# EAGLE schematic bitslice (EAGLE 6.3)
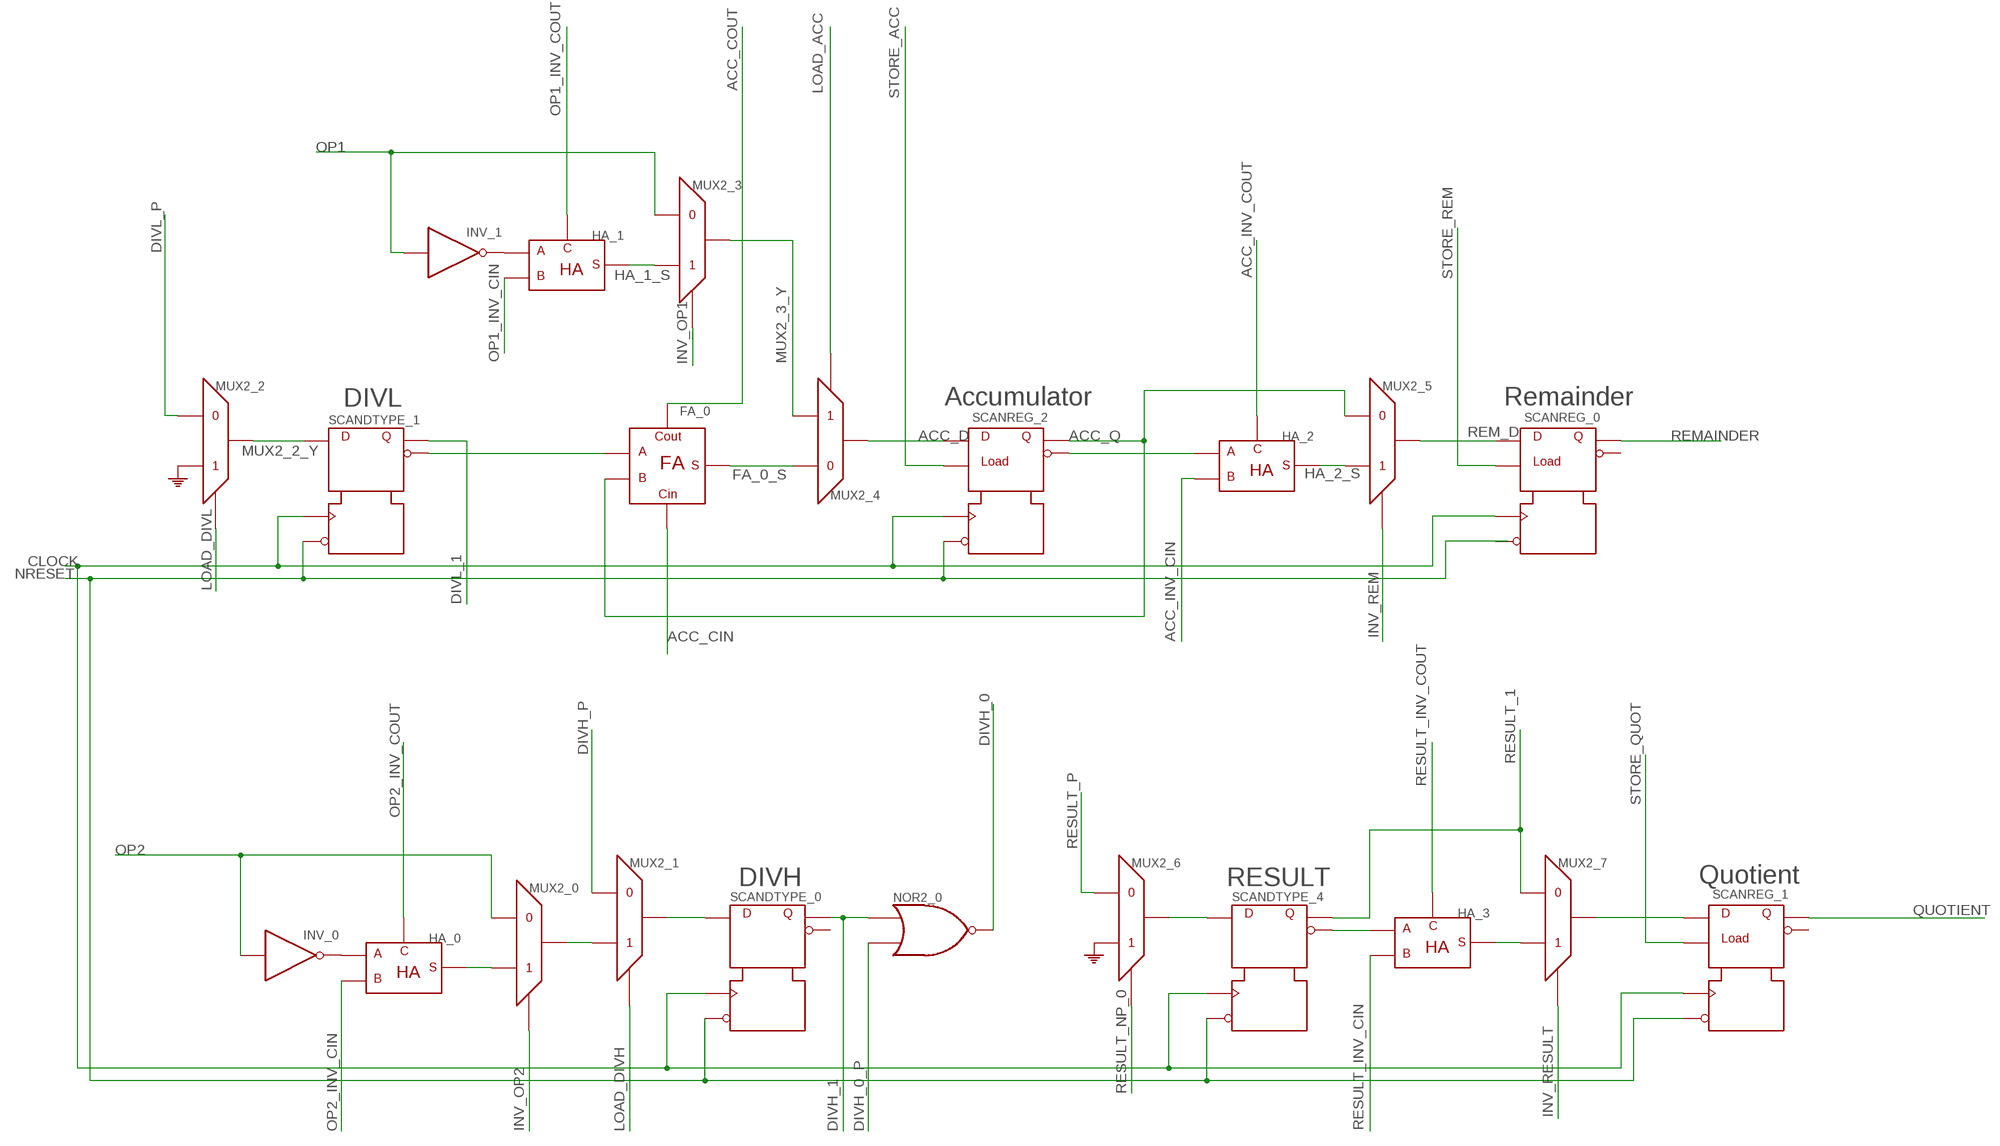
[diagram p0: schematic, sheet 1]

## Parts
FA_0  FULLADDER  [5PIN]
HA_0  HALFADDER  [5PIN]
HA_1  HALFADDER  [5PIN]
HA_2  HALFADDER  [5PIN]
HA_3  HALFADDER  [5PIN]
INV_0  INV  [3PIN]
INV_1  INV  [3PIN]
MUX2_0  MUX2  [5PIN]
MUX2_1  MUX2  [5PIN]
MUX2_2  MUX2  [5PIN]
MUX2_3  MUX2  [5PIN]
MUX2_4  MUX2  [5PIN]
MUX2_5  MUX2  [5PIN]
MUX2_6  MUX2  [5PIN]
MUX2_7  MUX2  [5PIN]
NOR2_0  NOR2  [3PIN]
SCANDTYPE_0  SCANDTYPE  [5PIN]
SCANDTYPE_1  SCANDTYPE  [5PIN]
SCANDTYPE_4  SCANDTYPE  [5PIN]
SCANREG_0  SCANREG  [6PIN]
SCANREG_1  SCANREG  [6PIN]
SCANREG_2  SCANREG  [6PIN]

## Nets
ACC_CIN: FA_0.P$3(CIN)
ACC_COUT: FA_0.P$4(COUT)
ACC_D: MUX2_4.P$3 SCANREG_2.P$2(D)
ACC_INV_CIN: HA_2.P$2(B)
ACC_INV_COUT: HA_2.P$3(COUT)
ACC_Q: FA_0.P$2(B) MUX2_5.P$1 SCANREG_2.P$6(Q)
CLOCK: SCANDTYPE_0.P$1(CLOCK) SCANDTYPE_1.P$1(CLOCK) SCANDTYPE_4.P$1(CLOCK) SCANREG_0.P$1(CLOCK) SCANREG_1.P$1(CLOCK) SCANREG_2.P$1(CLOCK)
DIVH_0: NOR2_0.P$3(O)
DIVH_0_P: NOR2_0.P$2(I1)
DIVH_1: NOR2_0.P$1(I0) SCANDTYPE_0.P$5(Q)
DIVH_P: MUX2_1.P$1
DIVL_1: SCANDTYPE_1.P$5(Q)
DIVL_P: MUX2_2.P$1
FA_0_S: FA_0.P$5(S) MUX2_4.P$1
HA_1_S: HA_1.P$4(S) MUX2_3.P$2
HA_2_S: HA_2.P$4(S) MUX2_5.P$2
INV_OP1: MUX2_3.P$4
INV_OP2: MUX2_0.P$4
INV_REM: MUX2_5.P$4
INV_RESULT: MUX2_7.P$4
LOAD_ACC: MUX2_4.P$4
LOAD_DIVH: MUX2_1.P$4
LOAD_DIVL: MUX2_2.P$4
MUX2_2_Y: MUX2_2.P$3 SCANDTYPE_1.P$2(D)
MUX2_3_Y: MUX2_3.P$3 MUX2_4.P$2
N$1: HA_0.P$1(A) INV_0.P$2(O)
N$2: MUX2_1.P$3 SCANDTYPE_0.P$2(D)
N$3: HA_0.P$4(S) MUX2_0.P$2
N$5: MUX2_6.P$3 SCANDTYPE_4.P$2(D)
N$6: MUX2_0.P$3 MUX2_1.P$2
N$8: HA_2.P$1(A) SCANREG_2.P$4(NQ)
N$9: FA_0.P$1(A) SCANDTYPE_1.P$3(NQ)
N$12: HA_1.P$1(A) INV_1.P$2(O)
N$14: HA_3.P$1(A) SCANDTYPE_4.P$3(NQ)
N$15: HA_3.P$4(S) MUX2_7.P$2
N$17: MUX2_7.P$3 SCANREG_1.P$2(D)
NRESET: SCANDTYPE_0.P$4(NRESET) SCANDTYPE_1.P$4(NRESET) SCANDTYPE_4.P$4(NRESET) SCANREG_1.P$5(NRESET) SCANREG_2.P$5(NRESET)
OP1: INV_1.P$1(I) MUX2_3.P$1
OP1_INV_CIN: HA_1.P$2(B)
OP1_INV_COUT: HA_1.P$3(COUT)
OP2: INV_0.P$1(I) MUX2_0.P$1
OP2_INV_CIN: HA_0.P$2(B)
OP2_INV_COUT: HA_0.P$3(COUT)
PE: MUX2_2.P$2 MUX2_6.P$2 ; supply symbol labelled TIELOW
QUOTIENT: SCANREG_1.P$6(Q)
REM_D: MUX2_5.P$3 SCANREG_0.P$2(D)
REMAINDER: SCANREG_0.P$6(Q)
RESULT_1: MUX2_7.P$1 SCANDTYPE_4.P$5(Q)
RESULT_INV_CIN: HA_3.P$2(B)
RESULT_INV_COUT: HA_3.P$3(COUT)
RESULT_NP_0: MUX2_6.P$4
RESULT_P: MUX2_6.P$1
STORE_ACC: SCANREG_2.P$3(LOAD)
STORE_QUOT: SCANREG_1.P$3(LOAD)
STORE_REM: SCANREG_0.P$3(LOAD)
Unconnected: SCANDTYPE_0.P$3(NQ) SCANREG_0.P$4(NQ) SCANREG_0.P$5(NRESET) SCANREG_1.P$4(NQ)

## Notes on the sheet
- DIVL | Accumulator | Remainder
- DIVH | RESULT | Quotient

## Library data of the parts
FA_0 = c035u:FULLADDER
HA_0 HA_1-HA_3 = c035u:HALFADDER
INV_0 INV_1 = c035u:INV
MUX2_0 MUX2_1-MUX2_7 = c035u:MUX2
NOR2_0 = c035u:NOR2
SCANDTYPE_0 SCANDTYPE_1 SCANDTYPE_4 = c035u:SCANDTYPE
SCANREG_0 SCANREG_1 SCANREG_2 = c035u:SCANREG